# EAGLE design UltimateFoosball (EAGLE 9.5.2)
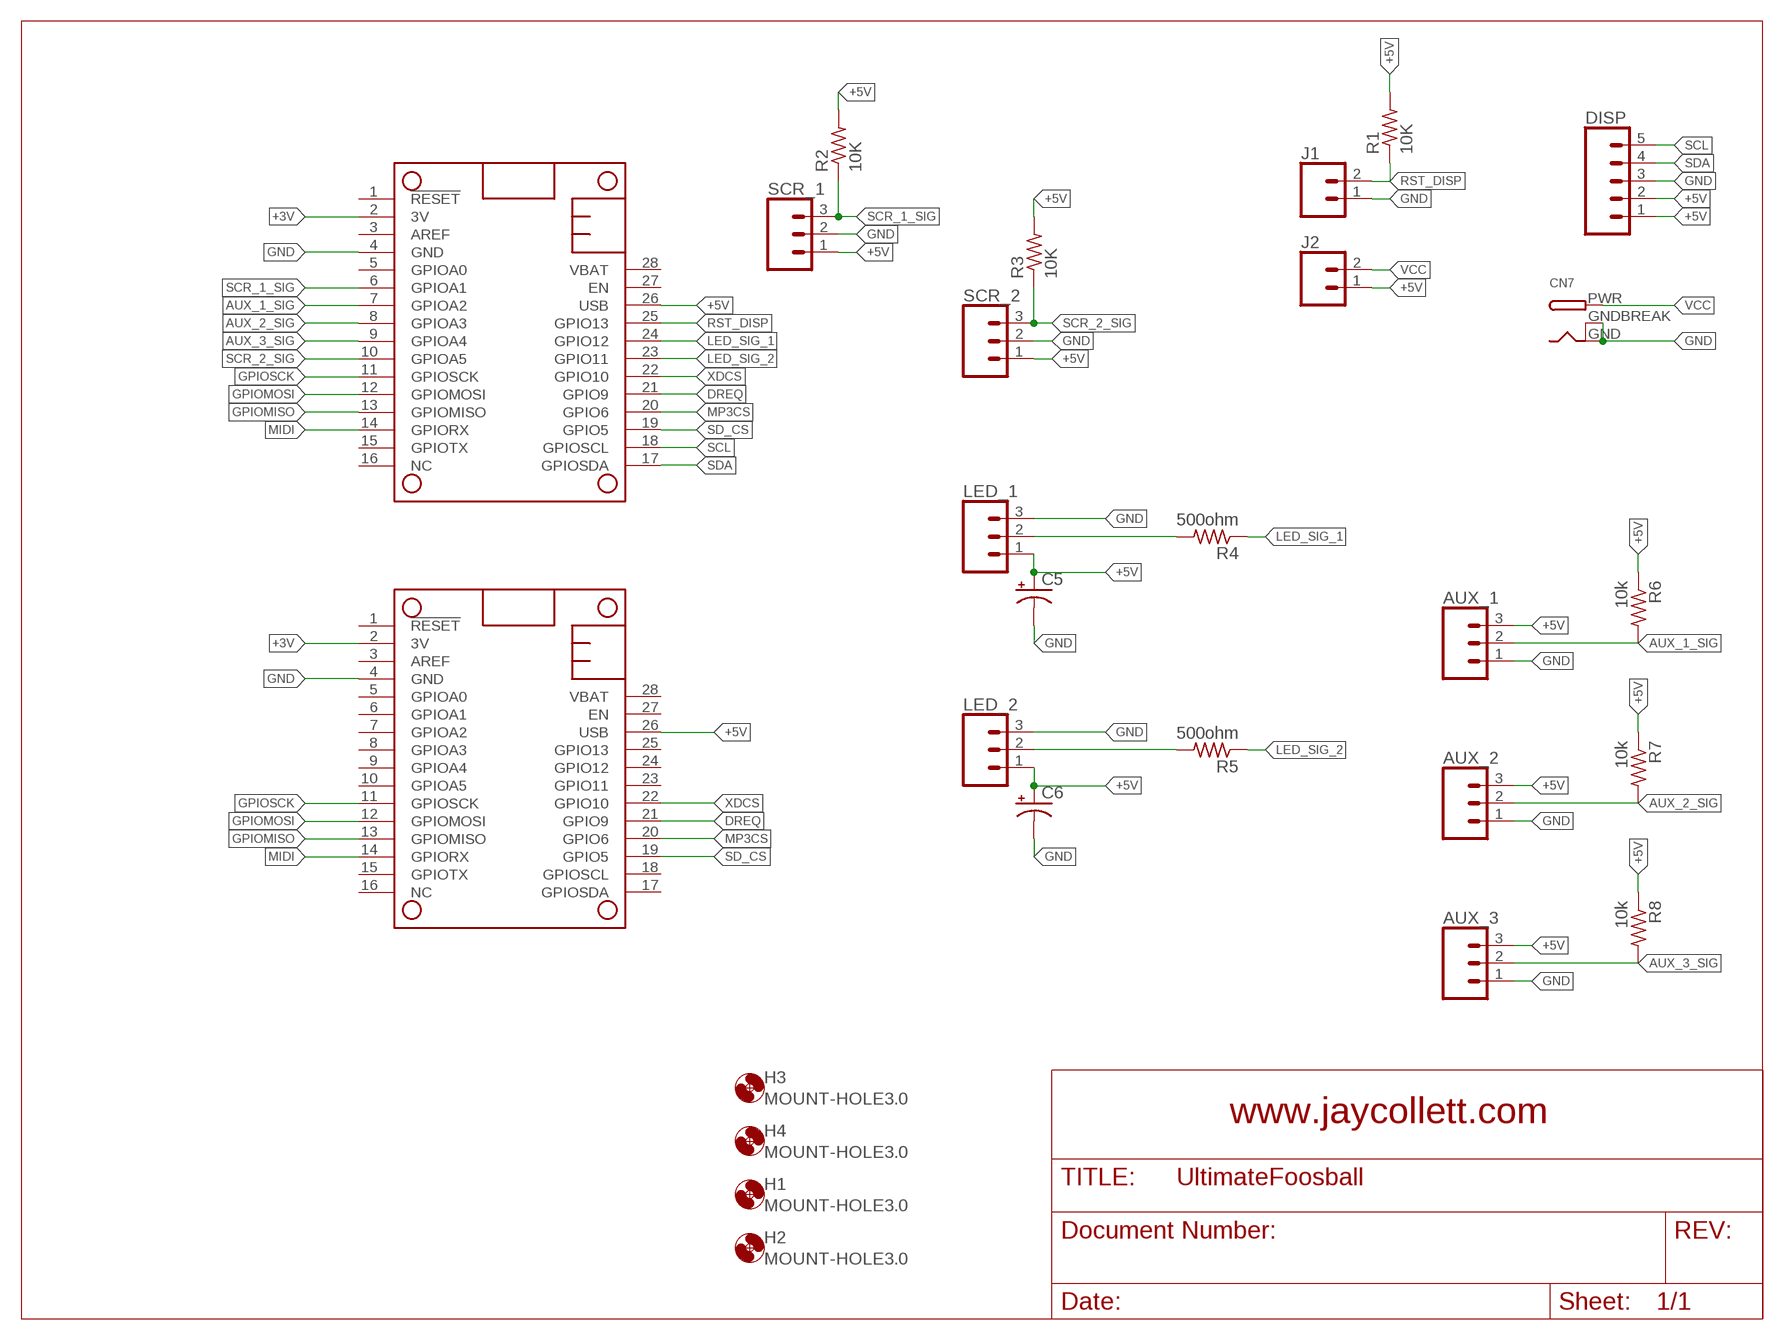
[diagram p0: schematic, sheet 1]

## Parts
AUX_1  CONN_03  [1X03]
AUX_2  CONN_03  [1X03]
AUX_3  CONN_03  [1X03]
C5  CPOL-USE5-13  [E5-13]
C6  CPOL-USE5-13  [E5-13]
CN7  DCBARRELPTH  [DCJACK_2MM_PTH]
DISP  CONN_05  [1X05]
H1  MOUNT-HOLE3.0  [3,0]
H2  MOUNT-HOLE3.0  [3,0]
H3  MOUNT-HOLE3.0  [3,0]
H4  MOUNT-HOLE3.0  [3,0]
J1  CONN_02PTH3  [1X02_LONGPADS]
J2  CONN_02PTH3  [1X02_LONGPADS]
LED_1  CONN_03  [1X03]
LED_2  CONN_03  [1X03]
MS1  FEATHERWING_NODIM  [FEATHERWING_DIM]
MUSIC_WING  FEATHERWING_NODIM  [FEATHERWING_DIM]
R1  10K  R-US_0309/12  [0309/12]
R2  10K  R-US_0309/12  [0309/12]
R3  10K  R-US_0309/12  [0309/12]
R4  500ohm  R-US_0309/12  [0309/12]
R5  500ohm  R-US_0309/12  [0309/12]
R6  10k  R-US_0309/12  [0309/12]
R7  10k  R-US_0309/12  [0309/12]
R8  10k  R-US_0309/12  [0309/12]
SCR_1  CONN_03  [1X03]
SCR_2  CONN_03  [1X03]

## Nets
+3V [3V_RAIL]: MS1.2(3V) MUSIC_WING.2(3V)
+5V: AUX_1.3 AUX_2.3 AUX_3.3 C5.+ C6.+ DISP.1 DISP.2 J2.1 LED_1.1 LED_2.1 MS1.26(USB) MUSIC_WING.26(USB) R1.2 R2.2 R3.2 R6.1 R7.1 R8.1 SCR_1.1 SCR_2.1
AUX_1_SIG: AUX_1.2 MS1.7(GPIOA2) R6.2
AUX_2_SIG: AUX_2.2 MS1.8(GPIOA3) R7.2
AUX_3_SIG: AUX_3.2 MS1.9(GPIOA4) R8.2
DREQ: MS1.21(GPIO9) MUSIC_WING.21(GPIO9)
GND: AUX_1.1 AUX_2.1 AUX_3.1 C5.- C6.- CN7.GND CN7.GNDBREAK DISP.3 J1.1 LED_1.3 LED_2.3 MS1.4(GND) MUSIC_WING.4(GND) SCR_1.2 SCR_2.2
GPIOMISO: MS1.13(GPIOMISO) MUSIC_WING.13(GPIOMISO)
GPIOMOSI: MS1.12(GPIOMOSI) MUSIC_WING.12(GPIOMOSI)
GPIOSCK: MS1.11(GPIOSCK) MUSIC_WING.11(GPIOSCK)
LED_SIG_1: MS1.24(GPIO12) R4.1
LED_SIG_2: MS1.23(GPIO11) R5.1
MIDI: MS1.14(GPIORX) MUSIC_WING.14(GPIORX)
MP3CS: MS1.20(GPIO6) MUSIC_WING.20(GPIO6)
N$2: LED_1.2 R4.2
N$5: LED_2.2 R5.2
RST_DISP: J1.2 MS1.25(GPIO13) R1.1
SCL: DISP.5 MS1.18(GPIOSCL)
SCR_1_SIG: MS1.6(GPIOA1) R2.1 SCR_1.3
SCR_2_SIG: MS1.10(GPIOA5) R3.1 SCR_2.3
SD_CS: MS1.19(GPIO5) MUSIC_WING.19(GPIO5)
SDA: DISP.4 MS1.17(GPIOSDA)
VCC: CN7.PWR J2.2
XDCS: MS1.22(GPIO10) MUSIC_WING.22(GPIO10)
Unconnected: MS1.1(!RESET) MS1.3(AREF) MS1.5(GPIOA0) MS1.15(GPIOTX) MS1.16(NC) MS1.27(EN) MS1.28(VBAT) MUSIC_WING.1(!RESET) MUSIC_WING.3(AREF) MUSIC_WING.5(GPIOA0) MUSIC_WING.6(GPIOA1) MUSIC_WING.7(GPIOA2) MUSIC_WING.8(GPIOA3) MUSIC_WING.9(GPIOA4) MUSIC_WING.10(GPIOA5) MUSIC_WING.15(GPIOTX) MUSIC_WING.16(NC) MUSIC_WING.17(GPIOSDA) MUSIC_WING.18(GPIOSCL) MUSIC_WING.23(GPIO11) MUSIC_WING.24(GPIO12) MUSIC_WING.25(GPIO13) MUSIC_WING.27(EN) MUSIC_WING.28(VBAT)

## Notes on the sheet
- www.jaycollett.com

## Library data of the parts
AUX_1-AUX_3 LED_1 LED_2 SCR_1 SCR_2 = SparkFun-Connectors:CONN_03: Multi connection point. Often used as Generic Header-pin footprint for 0.1 inch spaced/style header connections On any of the 0.1 inch spaced packages, you can populate with these: Break Away Headers - Straight <https://www.sparkfun.com/products/116> (PRT-00116) Break Away Male Headers - Right Angle <https://www.sparkfun.com/products/553> (PRT-00553) Female Headers <https://www.sparkfun.com/products/115> (PRT-00115) Break Away Headers - Machine Pin <https://www.sparkfun.com/products/117> (PRT-00117) Break Away Female Headers - Swiss Machine Pin <https://www.sparkfun.com/products/743> (PRT-00743) Stackable Header - 3 Pin (Female, 0.1") <https://www.sparkfun.com/products/13875> (PRT-13875) For SCREWTERMINALS and SPRING TERMINALS visit here: Screw Terimnals on SparkFun.com <https://www.sparkfun.com/search/results?term=Screw+Terminals> (5mm/3.5mm/2.54mm spacing) This device is also useful as a general connection point to wire up your design to another part of your project. Our various solder wires solder well into these plated through hole pads. Hook-Up Wire - Assortment (Stranded, 22 AWG) <https://www.sparkfun.com/products/11375> (PRT-11375) Hook-Up Wire - Assortment (Solid Core, 22 AWG) <https://www.sparkfun.com/products/11367> (PRT-11367) View the entire wire category on our website here <https://www.sparkfun.com/categories/141> Special notes: Molex polarized connector foot print use with SKU : PRT-08232 with associated crimp pins and housings.
C5 C6 = adafruit:CPOL-US: POLARIZED CAPACITOR, American symbol
CN7 = adafruit:DCBARREL: 2.0mm DC Barrel Jack DCJACK_2MM_PTH - Through Hole Jack (4UConnector: 05537)
DISP = SparkFun-Connectors:CONN_05: Multi connection point. Often used as Generic Header-pin footprint for 0.1 inch spaced/style header connections On any of the 0.1 inch spaced packages, you can populate with these: Break Away Headers - Straight <https://www.sparkfun.com/products/116> (PRT-00116) Break Away Male Headers - Right Angle <https://www.sparkfun.com/products/553> (PRT-00553) Female Headers <https://www.sparkfun.com/products/115> (PRT-00115) Break Away Headers - Machine Pin <https://www.sparkfun.com/products/117> (PRT-00117) Break Away Female Headers - Swiss Machine Pin <https://www.sparkfun.com/products/743> (PRT-00743) For SCREWTERMINALS and SPRING TERMINALS visit here: Screw Terimnals on SparkFun.com <https://www.sparkfun.com/search/results?term=Screw+Terminals> (5mm/3.5mm/2.54mm spacing) This device is also useful as a general connection point to wire up your design to another part of your project. Our various solder wires solder well into these plated through hole pads. Hook-Up Wire - Assortment (Stranded, 22 AWG) <https://www.sparkfun.com/products/11375> (PRT-11375) Hook-Up Wire - Assortment (Solid Core, 22 AWG) <https://www.sparkfun.com/products/11367> (PRT-11367) View the entire wire category on our website here <https://www.sparkfun.com/categories/141> Special notes: Molex polarized connector foot print use with SKU : PRT-08231 with associated crimp pins and housings. 1MM SMD Version SKU: PRT-10208
H1-H4 = holes:MOUNT-HOLE: MOUNTING HOLE with drill center marker
J1 J2 = SparkFun-Connectors:CONN_02: Multi connection point. Often used as Generic Header-pin footprint for 0.1 inch spaced/style header connections On any of the 0.1 inch spaced packages, you can populate with these: Break Away Headers - Straight <https://www.sparkfun.com/products/116> (PRT-00116) Break Away Male Headers - Right Angle <https://www.sparkfun.com/products/553> (PRT-00553) Female Headers <https://www.sparkfun.com/products/115> (PRT-00115) Break Away Headers - Machine Pin <https://www.sparkfun.com/products/117> (PRT-00117) Break Away Female Headers - Swiss Machine Pin <https://www.sparkfun.com/products/743> (PRT-00743) For SCREWTERMINALS and SPRING TERMINALS visit here: Screw Terimnals on SparkFun.com <https://www.sparkfun.com/search/results?term=Screw+Terminals> (5mm/3.5mm/2.54mm spacing) This device is also useful as a general connection point to wire up your design to another part of your project. Our various solder wires solder well into these plated through hole pads. Hook-Up Wire - Assortment (Stranded, 22 AWG) <https://www.sparkfun.com/products/11375> (PRT-11375) Hook-Up Wire - Assortment (Solid Core, 22 AWG) <https://www.sparkfun.com/products/11367> (PRT-11367) View the entire wire category on our website here <https://www.sparkfun.com/categories/141> Special notes: Molex polarized connector foot print use with: PRT-08233 with associated crimp pins and housings. 2.54_SCREWTERM for use with PRT-10571. 3.5mm Screw Terminal footprints for PRT-08084 5mm Screw Terminal footprints for use with PRT-08432
MS1 MUSIC_WING = adafruit:FEATHERWING
R1-R8 = adafruit:R-US_: RESISTOR, American symbol

## Net classes
2 3V_RAIL: width 0.406 mm

## Board
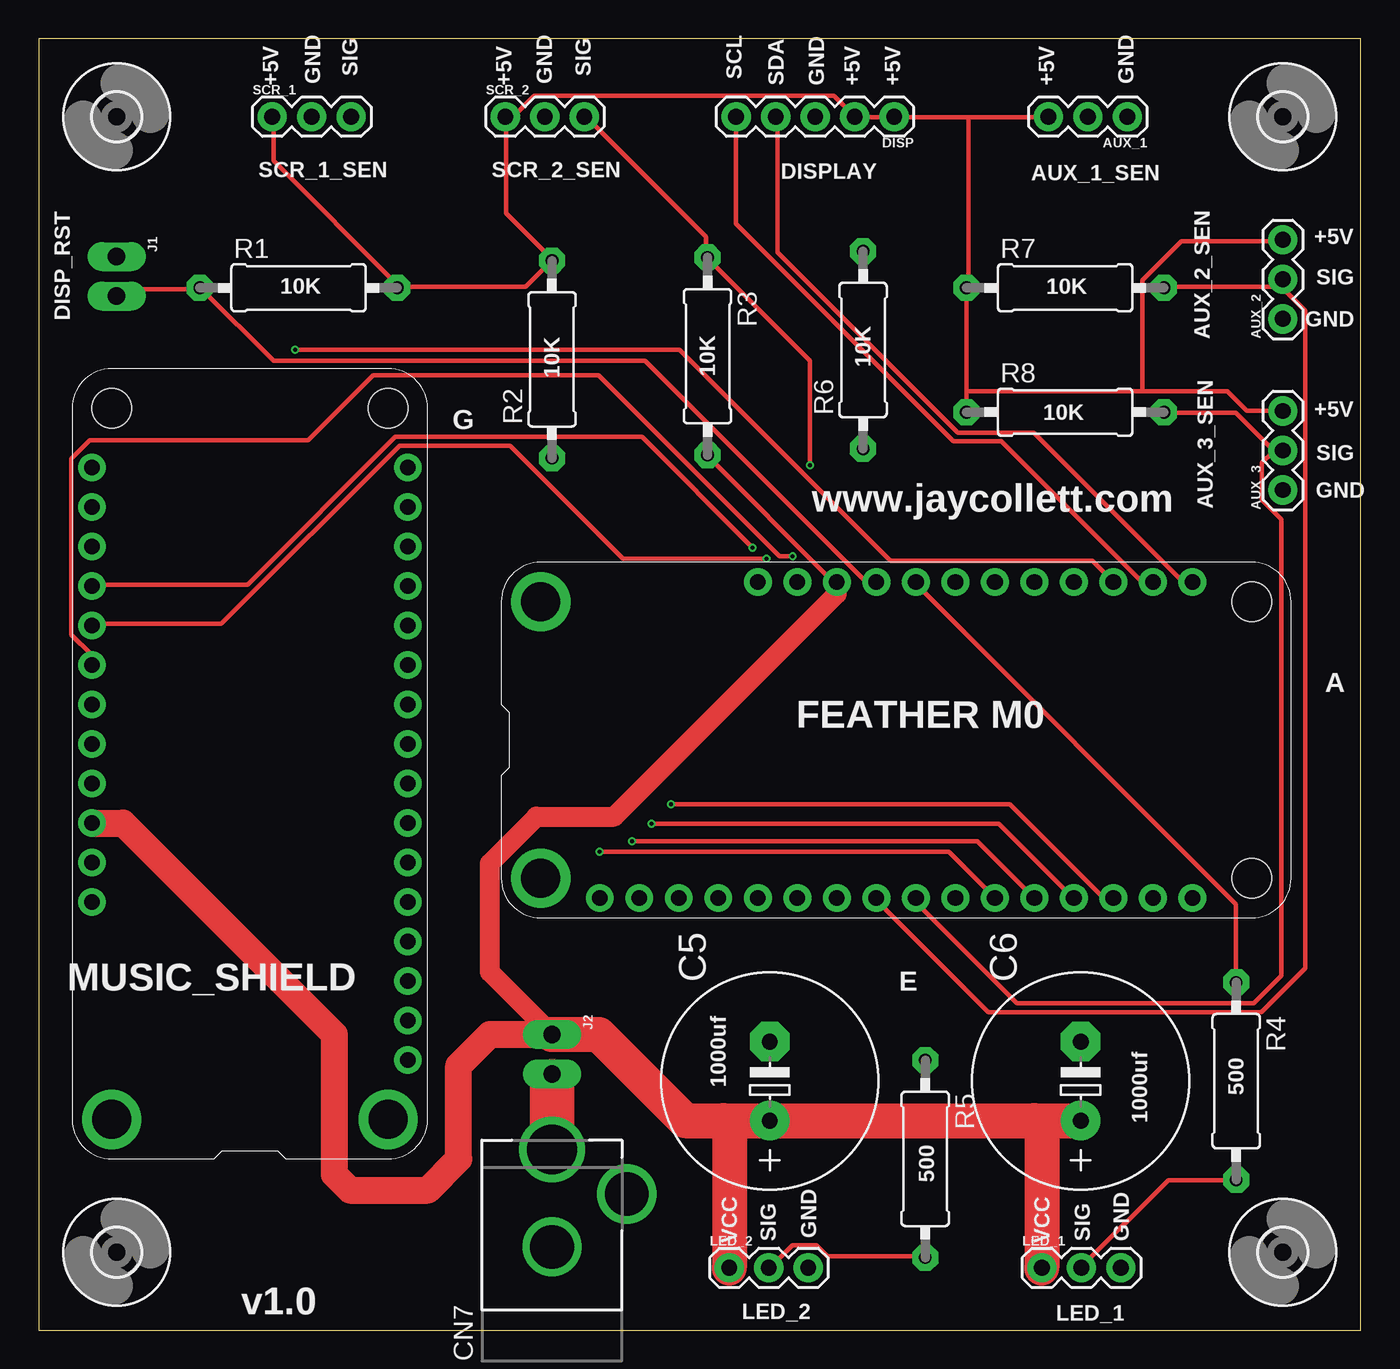
[diagram p1: board, top side]
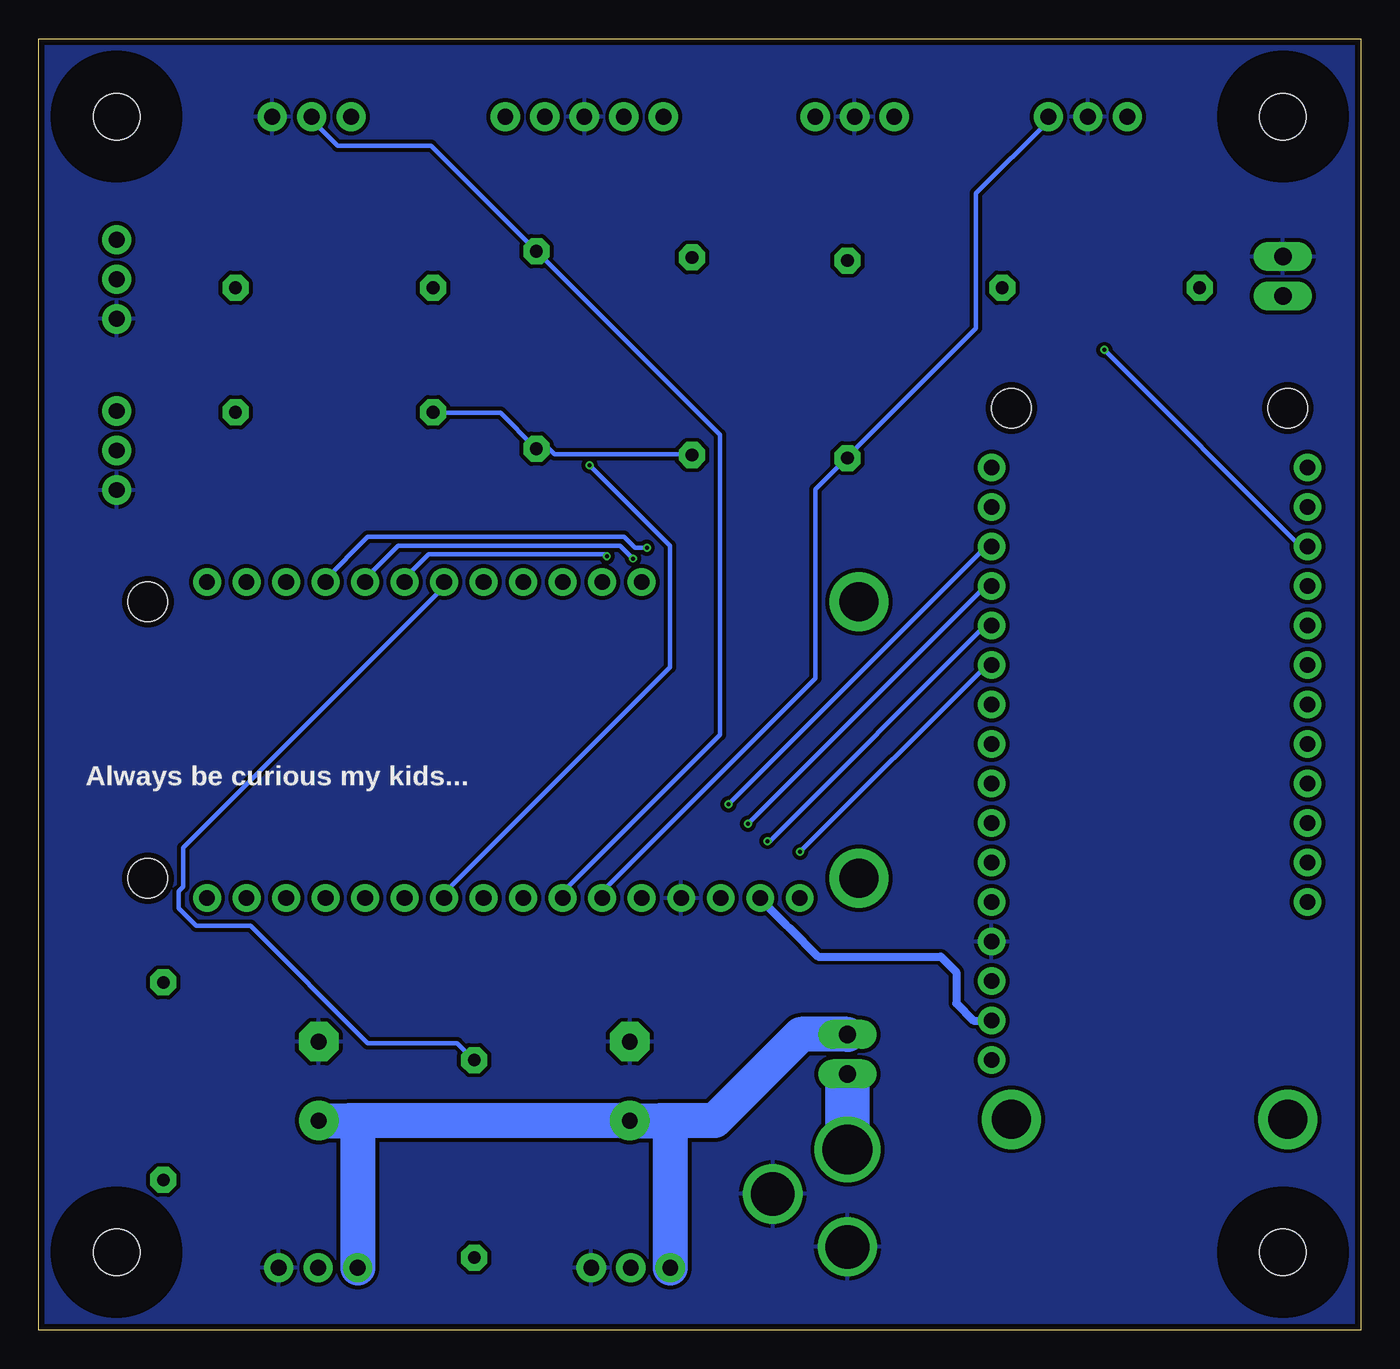
[diagram p2: board, bottom side, seen from below]

Size 85 x 83 mm. Coordinates in mm from the lower left corner, seen from the top.
Outline: 0,0 85,0 85,83 0,83 0,0
Copper layers (1*16): Top 0.035559375mm / dielectric 1.6mm / Bottom 0.035559375mm
Design rules "default *": minimum track width 12mil, minimum drill 10mil, track to track 10mil, track to pad 10mil, pad to pad 10mil, via to via 10mil, smd to smd 10mil, copper to edge 15mil, drill to drill 6mil, minimum pad ring 5mil, minimum via ring 5mil, stop-mask expansion 2.5mil, vias tented up to drill 20mil, thermal gap 10mil

### Footprints (pad centres in the part's own frame; a part is rotated, then mirrored left to right if it is on the bottom)
1X03 = drill 1.016 pad 1.88: 1 0,0; 2 2.54,0; 3 5.08,0
E5-13 = drill 1.016 pad 2.54: + -2.54,0 | drill 1.016 pad 2.54 octagon: - 2.54,0
DCJACK_2MM_PTH = drill 2.8: GND 0,7.35; GNDBREAK 4.8,10.75 | drill 3.2: PWR 0,13.6
1X05 = drill 1.016 pad 1.88: 1 0,0; 2 2.54,0; 3 5.08,0; 4 7.62,0; 5 10.16,0
3,0 = hole 3: 0,0
1X02_LONGPADS = drill 1.118 pad 1.88 long: 1 0,0; 2 2.54,0
FEATHERWING_DIM = drill 1 pad 1.778: 1 6.35,1.27; 2 8.89,1.27; 3 11.43,1.27; 4 13.97,1.27; 5 16.51,1.27; 6 19.05,1.27; 7 21.59,1.27; 8 24.13,1.27; 9 26.67,1.27; 10 29.21,1.27; 11 31.75,1.27; 12 34.29,1.27; 13 36.83,1.27; 14 39.37,1.27; 15 41.91,1.27; 16 44.45,1.27; 17 44.45,21.59; 18 41.91,21.59; 19 39.37,21.59; 20 36.83,21.59; 21 34.29,21.59; 22 31.75,21.59; 23 29.21,21.59; 24 26.67,21.59; 25 24.13,21.59; 26 21.59,21.59; 27 19.05,21.59; 28 16.51,21.59 | drill 2.5 pad 3.81: P$1 2.54,20.32; P$2 2.54,2.54 | hole 2.54: 48.26,20.32; 48.26,2.54
0309/12 = drill 0.813 pad 1.676 octagon: 1 -6.35,0; 2 6.35,0

### Placement (x,y rotation side)
AUX_1  70,78 180 top
AUX_2  80,65 90 top
AUX_3  80,54 90 top
C5  47,16 90 top
C6  67,16 90 top
CN7  33,-2 0 top
DISP  55,78 180 top
H1  5,78 0 top
H2  80,78 0 top
H3  80,5 0 top
H4  5,5 0 top
J1  5,69 270 top
J2  33,19 270 top
LED_1  64.5,4 0 top
LED_2  44.4,4 0 top
MS1  29.73,26.5 0 top
MUSIC_WING  25,11 90 top
R1  16.7,67 0 top
R2  33,62.4 90 top
R3  43,62.6 270 top
R4  77,16 270 top
R5  57,11 270 top
R6  53,63 90 top
R7  66,67 0 top
R8  66,59 0 top
SCR_1  15,78 0 top
SCR_2  30,78 0 top

### Tracks (layer width: path | path; a pad name or v marks a point on that pad's centre or on a via)
+3V
  Bottom 0.5: MS1.2 38.56,27.66 36.95,26.05 36.74,25.84 34.9,24 27,24 26,23 26,21 24.89,19.89 MUSIC_WING.2
+5V
  Top 0.305: SCR_1.1 15.09,77.95 15.09,75.16 23.05,67.2 R1.2 23.05,67.06 31.29,67.06 32.97,68.73 R2.2 32.97,68.87 30.04,71.81 30.04,77.95 SCR_2.1 30.18,77.95 30.45,77.95 31.85,79.35 51.13,79.35 52.39,78.09 DISP.2 52.53,77.95 54.9,77.95 DISP.1 55.04,77.95 59.79,77.95 | 59.79,77.95 64.82,77.95 AUX_1.3 | R3.2 43.03,56.16 50.85,48.34 MS1.26 | 59.65,60.35 59.65,59.09 R8.1 | 59.65,60.35 59.65,66.92 R7.1 59.79,67.06 59.79,77.95 | 59.65,60.35 70.97,60.35 | 70.97,60.35 76.42,60.35 77.67,59.09 79.91,59.09 AUX_3.3 | 70.97,60.35 70.97,67.47 73.48,69.99 79.91,69.99 AUX_2.3
  Top 1.27: J2.1 29,23 29,30 32,33 37,33 51.32,47.32 MS1.26
  Top 1.75: MUSIC_WING.26 5.41,32.59 19,19 19,10 20,9 25,9 27,11 27,17 29,19 J2.1
  Top 2.25: J2.1 36,19 41.54,13.46 44,13.46 | 44,13.46 C5.+ 64,13.46 | 64,13.46 C6.+ | 44,13.46 44.4,13.06 LED_2.1 | 64,13.46 64.5,12.96 LED_1.1
  Bottom 0.305: R8.1 59.51,58.95 55.32,58.95 53.09,56.72 R6.1 52.95,56.72 52.25,56.72 51.83,56.3 43.03,56.3 R3.2
  Bottom 2.25: J2.1 36,19 41.54,13.46 45,13.46 | 45,13.46 C5.+ 65,13.46 | C6.+ 65,13.46 | 45,13.46 44.4,12.86 LED_2.1 | 65,13.46 64.5,12.96 LED_1.1
AUX_1_SIG
  Bottom 0.305: AUX_1.2 67.33,77.95 67.33,77.67 65.8,76.14 59.79,76.14 53.09,69.43 R6.2 52.95,69.29 41.21,57.56 41.21,38.28 51.27,28.22 51.27,27.8 MS1.7
AUX_2_SIG
  Top 0.305: R7.2 72.36,67.06 79.49,67.06 79.91,67.47 AUX_2.2 79.77,67.2 81.44,65.52 81.44,23.27 78.61,20.44 61.05,20.44 53.86,27.62 MS1.8
AUX_3_SIG
  Top 0.305: R8.2 72.36,58.95 76.97,58.95 79.35,56.58 79.91,56.58 AUX_3.2 79.35,56.44 78.65,55.74 78.65,53.37 79.91,52.11 79.91,22.77 78.13,21 62.9,21 56.54,27.36 56.55,27.36 MS1.9
DREQ  (via drill 0.25)
  Top 0.305: v46.8,49.59 37.58,49.59 30.32,56.86 23.19,56.86 11.73,45.4 3.49,45.4 MUSIC_WING.21
  Bottom 0.305: v46.8,49.59 47.64,50.43 61.89,50.43 64.12,48.2 MS1.21
GND
  pour Bottom (isolate 0.16): 0,83 85,83 85,0 0,0
GPIOMISO  (via drill 0.25)
  Top 0.305: v39.4,32.55 61.75,32.55 66.5,27.8 MS1.13
  Bottom 0.305: v39.4,32.55 24.17,47.78 23.75,47.78 MUSIC_WING.13
GPIOMOSI  (via drill 0.25)
  Top 0.305: v38.14,31.43 60.35,31.43 63.98,27.8 MS1.12
  Bottom 0.305: v38.14,31.43 38,31.43 24.17,45.26 23.75,45.26 MUSIC_WING.12
GPIOSCK  (via drill 0.25)
  Top 0.305: v36.04,30.73 58.53,30.73 61.47,27.8 MS1.11
  Bottom 0.305: v36.04,30.73 24.03,42.75 23.75,42.75 MUSIC_WING.11
LED_SIG_1
  Top 0.305: R4.1 76.97,22.35 76.97,27.38 56.3,48.06 MS1.24
LED_SIG_2
  Bottom 0.305: R5.1 57.14,17.46 58.12,18.44 63.84,18.44 71.39,25.98 74.88,25.98 76,27.1 76,28.22 75.72,28.5 75.72,31.01 58.95,47.78 58.95,48.06 MS1.23
MIDI  (via drill 0.25)
  Top 0.305: v40.65,33.81 62.45,33.81 68.45,27.8 69.01,27.8 MS1.14
  Bottom 0.305: v40.65,33.81 24.17,50.29 23.75,50.29 MUSIC_WING.14
MP3CS  (via drill 0.25)
  Top 0.305: v45.9,50.29 38.78,57.42 22.91,57.42 13.41,47.92 3.49,47.92 MUSIC_WING.20
  Bottom 0.305: v45.9,50.29 46.66,50.29 47.36,50.99 63.84,50.99 66.64,48.2 MS1.20
N$2
  Top 0.305: R4.2 76.97,9.64 72.64,9.64 67.06,4.05 LED_1.2
N$5
  Top 0.305: R5.2 57,4.75 50.71,4.75 50.01,5.45 48.48,5.45 47.08,4.05 LED_2.2
RST_DISP
  Top 0.305: J1.2 5.03,66.5 5.45,66.92 10.34,66.92 R1.1 10.48,66.92 15.09,62.31 38.98,62.31 53.09,48.2 53.78,48.2 MS1.25
SCL
  Top 0.305: MS1.18 71.53,48.2 70.83,48.2 61.89,57.14 58.81,57.14 44.84,71.11 44.84,77.95 DISP.5
SCR_1_SIG
  Bottom 0.305: SCR_1.3 20.12,77.95 20.12,77.67 24.73,73.06 24.73,64.4 32.97,56.16 R2.1 33.11,56.02 35.06,54.06 35.06,41.91 48.76,28.22 48.76,27.8 MS1.6
SCR_2_SIG  (via drill 0.25)
  Top 0.305: SCR_2.3 35.2,77.95 42.89,70.27 42.89,69.01 R3.1 43.03,68.87 49.59,62.31 v49.59,55.6
  Bottom 0.305: v49.59,55.6 44.42,50.43 44.42,42.61 58.81,28.22 58.81,27.8 MS1.10
SD_CS  (via drill 0.25)
  Top 0.305: v16.48,63.01 41.21,63.01 54.76,49.45 67.75,49.45 69.01,48.2 MS1.19
  Bottom 0.305: v16.48,63.01 3.91,50.43 3.49,50.43 MUSIC_WING.19
SDA
  Top 0.305: MS1.17 74.04,48.2 73.48,48.2 63.98,57.7 59.09,57.7 47.5,69.29 47.5,77.95 DISP.4
VCC
  Top 0.305: J2.2 32.97,16.48 33,16
  Top 2.85: CN7.PWR 33,16
  Bottom 2.85: CN7.PWR 33,16
XDCS  (via drill 0.25)
  Top 0.305: v48.48,49.73 47.64,49.73 35.98,61.39 21.49,61.39 17.3,57.2 3.28,57.2 2.1,56.02 2.1,44.7 3.35,43.45 3.35,42.89 MUSIC_WING.22
  Bottom 0.305: v48.48,49.73 48.62,49.87 59.93,49.87 61.61,48.2 MS1.22

### Text on the board
tPlace: SIG | SIG | +5V | GND | +5V | GND | SCL | SDA | GND | +5V | +5V | +5V | GND | SCR_1_SEN | SCR_2_SEN | DISPLAY | AUX_1_SEN | +5V | 10K | SIG | 10K | GND | DISP_RST | AUX_2_SEN | 10K | 10K | 10K | 10K | +5V | G | SIG | GND | www.jaycollett.com | AUX_3_SEN | A | FEATHER M0 | MUSIC_SHIELD | E | 1000uf | 500 | 1000uf | 500 | VCC | SIG | GND | VCC | SIG | GND | v1.0 | LED_2 | LED_1
bPlace: Always be curious my kids...